# EAGLE design kolektorius_v2-be-klaidu (EAGLE 6.5.0)
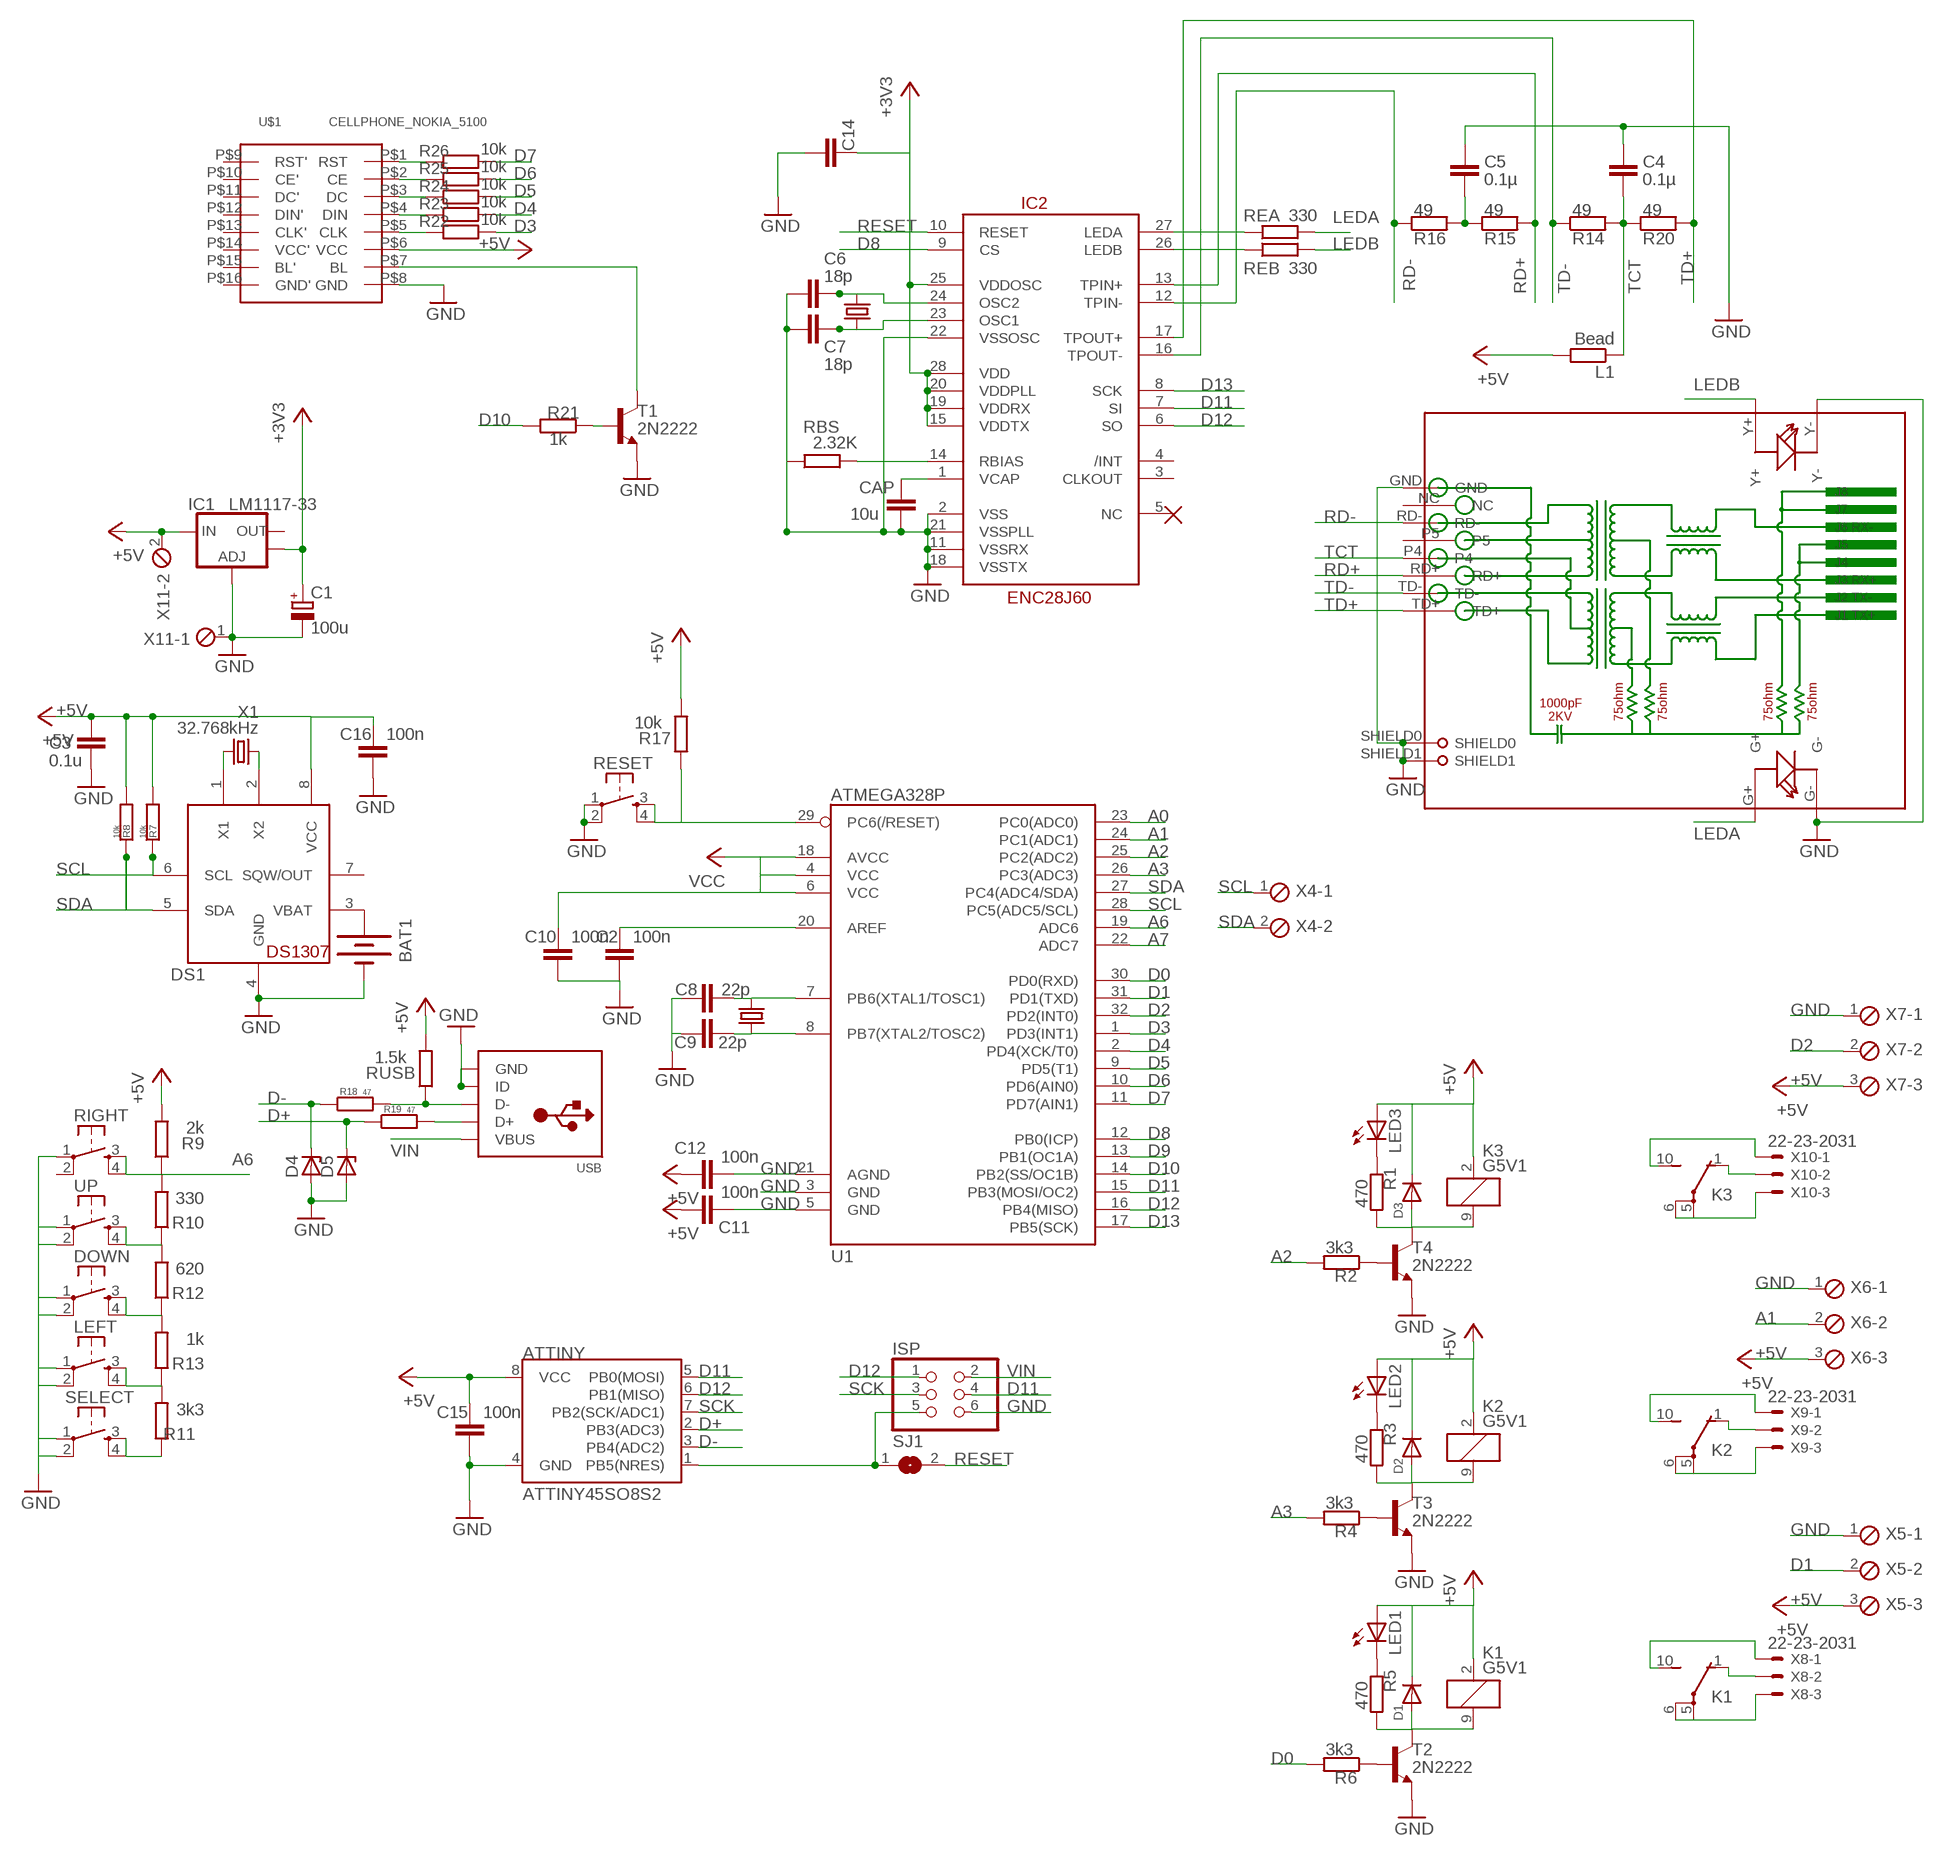
[diagram p0: schematic, sheet 1]

## Parts
ATTINY  ATTINY45SO8S2  [SO8S2]
BAT1  BATTERY20PTH  [BATTCOM_20MM_PTH]
C1  100u  CPOL-EUE2-5  [E2-5]
C2  100n  C-EUC0805  [C0805]
C3  0.1u  C-EUC0805  [C0805]
C4  0.1µ  C-EUC0805  [C0805]
C5  0.1µ  C-EUC0805  [C0805]
C6  18p  C-EUC0805  [C0805]
C7  18p  C-EUC0805  [C0805]
C8  22p  C-EUC0805  [C0805]
C9  22p  C-EUC0805  [C0805]
C10  100n  C-EUC0805  [C0805]
C11  100n  C-EUC0805  [C0805]
C12  100n  C-EUC0805  [C0805]
C14  100n  C-EUC0805  [C0805]
C15  100n  C-EUC0805  [C0805]
C16  100n  C-EUC0805  [C0805]
CAP  10u  C-EUC0805  [C0805]
D1  DIODEDO-1N4148  [DO-1N4148]
D2  DIODEDO-1N4148  [DO-1N4148]
D3  DIODEDO-1N4148  [DO-1N4148]
D4  ZENER-DIODEZD-5  [ZDIO-5]
D5  ZENER-DIODEZD-5  [ZDIO-5]
DOWN  TAC_SWITCHPTH  [TACTILE-PTH]
DS1  DS1307  DS1307SOIC  [SO08]
IC1  LM1117-33  V_REG_LM1117SOT223  [SOT223]
IC2  ENC28J60  [SSOP28DB]
ISP  PINHD-2X3  [2X03]
K1  G5V1  [G5V1]
K2  G5V1  [G5V1]
K3  G5V1  [G5V1]
L1  Bead  R-EU_R0805  [R0805]
LED1  LEDSMT1206  [1206]
LED2  LEDSMT1206  [1206]
LED3  LEDSMT1206  [1206]
LEFT  TAC_SWITCHPTH  [TACTILE-PTH]
R1  470  R-EU_R0805  [R0805]
R2  3k3  R-EU_R0805  [R0805]
R3  470  R-EU_R0805  [R0805]
R4  3k3  R-EU_R0805  [R0805]
R5  470  R-EU_R0805  [R0805]
R6  3k3  R-EU_R0805  [R0805]
R7  10k  R-EU_R0805  [R0805]
R8  10k  R-EU_R0805  [R0805]
R9  2k  R-EU_R0805  [R0805]
R10  330  R-EU_R0805  [R0805]
R11  3k3  R-EU_R0805  [R0805]
R12  620  R-EU_R0805  [R0805]
R13  1k  R-EU_R0805  [R0805]
R14  49  R-EU_R0805  [R0805]
R15  49  R-EU_R0805  [R0805]
R16  49  R-EU_R0805  [R0805]
R17  10k  R-EU_R0805  [R0805]
R18  47  R-EU_R0805  [R0805]
R19  47  R-EU_R0805  [R0805]
R20  49  R-EU_R0805  [R0805]
R21  1k  R-EU_R0805  [R0805]
R22  10k  R-EU_R0805  [R0805]
R23  10k  R-EU_R0805  [R0805]
R24  10k  R-EU_R0805  [R0805]
R25  10k  R-EU_R0805  [R0805]
R26  10k  R-EU_R0805  [R0805]
RBS  2.32K  R-EU_R0805  [R0805]
REA  330  R-EU_R0805  [R0805]
REB  330  R-EU_R0805  [R0805]
RESET  TAC_SWITCHPTH  [TACTILE-PTH]
RIGHT  TAC_SWITCHPTH  [TACTILE-PTH]
RJ1  HR911105A  [HR911105A]
RUSB  1.5k  R-EU_R0805  [R0805]
SELECT  TAC_SWITCHPTH  [TACTILE-PTH]
SJ1  SJ  [SJ]
T1  2N2222  [TO92-EBC-OVAL]
T2  2N2222  [TO92-EBC-OVAL]
T3  2N2222  [TO92-EBC-OVAL]
T4  2N2222  [TO92-EBC-OVAL]
U1  ATMEGA328P  ATMEGA328_SMT  [TQFP32-08]
U$1  CELLPHONE_NOKIA_5100  [CELLPHONE_NOKIA_5100_SPARKFUN]
UP  TAC_SWITCHPTH  [TACTILE-PTH]
USB  USBMOLEX  [USB-MINIB-THM-MOLEX]
X1  32.768kHz  CRYSTALTC26H  [TC26H]
X2  16MHz  CRYSTALHC49US  [HC49US]
X3  25MHz  CRYSTALHC49US  [HC49US]
X4  MPT2  [2POL254]
X5  MPT3  [3POL254]
X6  MPT3  [3POL254]
X7  MPT3  [3POL254]
X8  22-23-2031  [22-23-2031]
X9  22-23-2031  [22-23-2031]
X10  22-23-2031  [22-23-2031]
X11  MPT2  [2POL254]

## Nets
+3V3: C1.+ C14.1 IC1.4(OUT) IC2.15(VDDTX) IC2.19(VDDRX) IC2.20(VDDPLL) IC2.25(VDDOSC) IC2.28(VDD)
+5V: ATTINY.8(VCC) C3.1 C10.1 C11.2 C12.2 C15.1 C16.1 D1.C D2.C D3.C DS1.8(VCC) IC1.3(IN) K1.2 K2.2 K3.2 L1.2 LED1.A LED2.A R7.2 R8.2 R9.2 R17.2 RUSB.2 U1.4(VCC) U1.6(VCC) U1.18(AVCC) U$1.P$6(VCC) X5.3 X6.3 X7.3 X11.2 ; supply symbol labelled VCC
A0: U1.23(PC0(ADC0))
A1: U1.24(PC1(ADC1)) X6.2
A2: R2.2 U1.25(PC2(ADC2))
A3: R4.2 U1.26(PC3(ADC3))
A6: R9.1 R10.2 RIGHT.3 RIGHT.4 U1.19(ADC6)
A7: U1.22(ADC7)
D0: R6.2 U1.30(PD0(RXD))
D1: U1.31(PD1(TXD)) X5.2
D2: U1.32(PD2(INT0)) X7.2
D3: R22.2 U1.1(PD3(INT1))
D4: R23.2 U1.2(PD4(XCK/T0))
D5: R24.2 U1.9(PD5(T1))
D6: R25.2 U1.10(PD6(AIN0))
D7: R26.2 U1.11(PD7(AIN1))
D8: IC2.9(CS) U1.12(PB0(ICP))
D9: U1.13(PB1(OC1A))
D10: R21.2 U1.14(PB2(SS/OC1B))
D11: ATTINY.5(PB0(MOSI)) IC2.7(SI) ISP.4 U1.15(PB3(MOSI/OC2))
D12: ATTINY.6(PB1(MISO)) IC2.6(SO) ISP.1 U1.16(PB4(MISO))
D13: IC2.8(SCK) U1.17(PB5(SCK))
D+: ATTINY.2(PB3(ADC3)) D5.C R19.1
D-: ATTINY.3(PB4(ADC2)) D4.C R18.1
GND: ATTINY.4(GND) BAT1.2(-) C1.- C2.2 C3.2 C4.1 C5.1 C6.2 C7.2 C8.1 C9.1 C10.2 C11.1 C12.1 C14.2 C15.2 C16.2 CAP.2 D4.A D5.A DOWN.1 DOWN.2 DS1.4(GND) IC1.1(ADJ) IC2.2(VSS) IC2.11(VSSRX) IC2.18(VSSTX) IC2.21(VSSPLL) IC2.22(VSSOSC) ISP.6 LEFT.1 LEFT.2 RBS.1 RESET.1 RESET.2 RIGHT.1 RJ1.G- RJ1.GND RJ1.SHIELD0 RJ1.SHIELD1 RJ1.Y- SELECT.1 SELECT.2 T1.E T2.E T3.E T4.E U1.3(GND) U1.5(GND) U1.21(AGND) U$1.P$8(GND) UP.1 UP.2 USB.GND USB.ID X5.1 X6.1 X7.1 X11.1
LEDA: REA.2 RJ1.G+
LEDB: REB.2 RJ1.Y+
N$1: LEFT.3 LEFT.4 R11.2 R13.1
N$2: D2.A K2.9 R3.2 T3.C
N$3: R4.1 T3.B
N$4 [power]: K2.5(2:P) K2.6(2:P) X9.3
N$5 [power]: K2.1(2:O) X9.2
N$6: DOWN.3 DOWN.4 R12.1 R13.2
N$7: LED2.C R3.1
N$8: DS1.1(X1) X1.2
N$9: R10.1 R12.2 UP.3 UP.4
N$11: D1.A K1.9 R5.2 T2.C
N$12: D3.A K3.9 R1.2 T4.C
N$13: R2.1 T4.B
N$14 [power]: K2.10(2:S) X9.1
N$15 [power]: K1.10(2:S) X8.1
N$16 [power]: K3.10(2:S) X10.1
N$17: R6.1 T2.B
N$18: R11.1 SELECT.3 SELECT.4
N$19 [power]: K3.5(2:P) K3.6(2:P) X10.3
N$20 [power]: K3.1(2:O) X10.2
N$21: LED3.C R1.1
N$22: R22.1 U$1.P$5(CLK)
N$23: R25.1 U$1.P$2(CE)
N$24: R24.1 U$1.P$3(DC)
N$25: R23.1 U$1.P$4(DIN)
N$26 [signal]: T1.C U$1.P$7(BL)
N$27: LED3.A
N$28 [power]: K1.5(2:P) K1.6(2:P) X8.3
N$29 [power]: K1.1(2:O) X8.2
N$30: DS1.2(X2) X1.1
N$31: LED1.C R5.1
N$32: C9.2 U1.8(PB7(XTAL2/TOSC2)) X2.1
N$33: C8.2 U1.7(PB6(XTAL1/TOSC1)) X2.2
N$34: IC2.27(LEDA) REA.1
N$35: C2.1 U1.20(AREF)
N$36: BAT1.1(+) DS1.3(VBAT)
N$37: IC2.26(LEDB) REB.1
N$38: R19.2 USB.D+
N$39: CAP.1 IC2.1(VCAP)
N$41: C6.1 IC2.24(OSC2) X3.2
N$42: C7.1 IC2.23(OSC1) X3.1
N$44: R21.1 T1.B
N$45: R18.2 RUSB.1 USB.D-
N$46: R17.1 RESET.3 RESET.4 U1.29(PC6(/RESET))
N$52: ATTINY.1(PB5(NRES)) ISP.5 SJ1.1
N$54: C5.2 R15.1 R16.2
N$59: IC2.14(RBIAS) RBS.2
RD+: IC2.13(TPIN+) R15.2 RJ1.RD+
RD-: IC2.12(TPIN-) R16.1 RJ1.RD-
RESET: IC2.10(RESET) SJ1.2
SCK: ATTINY.7(PB2(SCK/ADC1)) ISP.3
SCL: DS1.6(SCL) R7.1 U1.28(PC5(ADC5/SCL)) X4.1
SDA: DS1.5(SDA) R8.1 U1.27(PC4(ADC4/SDA)) X4.2
TCT: C4.2 L1.1 R14.2 R20.1 RJ1.P4
TD+: IC2.17(TPOUT+) R20.2 RJ1.TD+
TD-: IC2.16(TPOUT-) R14.1 RJ1.TD-
V$: R26.1 U$1.P$1(RST)
VIN: ISP.2 USB.VBUS
Unconnected: DS1.7(SQW/OUT) IC1.2(OUT) IC2.3(CLKOUT) IC2.4(/INT) IC2.5(NC) RIGHT.2 RJ1.NC RJ1.P5 U$1.P$9(RST') U$1.P$10(CE') U$1.P$11(DC') U$1.P$12(DIN') U$1.P$13(CLK') U$1.P$14(VCC') U$1.P$15(BL') U$1.P$16(GND')

## Library data of the parts
ATTINY = SparkFun:ATTINY45: Atmel ATTiny45
BAT1 = SparkFun-Electromechanical:BATTERY: Battery Holders Various common sizes : AA, AAA, 20mm coin cell and 12mm coin cell. 20MM_4LEGS, BATT-10373
C1 = resistor:CPOL-EU: POLARIZED CAPACITOR, European symbol
C2 C4-C12 C14-C16 CAP = resistor:C-EU: CAPACITOR, European symbol
C3 = rcl:C-EU: CAPACITOR, European symbol
D1-D3 = adafruit:DIODE: Diode SMADIODE - SMA Surface Mount Package 20V 1A Schottky Diode Digikey: 641-1014-6-ND DO-1N4148 - Through Hole Small Current Diode SOD-123 20V 1 A (.5mV Vf) Schottky Diode - Digikey: MBRX120TPMSCT-ND SOD-323 10V 570mA (.38mV Vf, 3ns) Schottky Diode - Digikey: ZLLS410CT-ND SOD-523 30V 30mA Schottky Diode (RB751S-40TE61) - Digikey: RB751S-40TE61CT-ND SOT23-R/W - SOT23 Package (R = Solder Paste/Reflow Ovens, W = Hand-Soldering) BAT54Film 40V 300mA - Digikey: 497-7162-1-ND
D4 D5 = diode:ZENER-DIODE: Z-Diode
DOWN LEFT RESET RIGHT SELECT UP = SparkFun-Electromechanical:TAC_SWITCH: Momentary Switch Button commonly used for reset or general input. Spark Fun Electronics SKU : COM-00097 SMT- SWCH-08247
DS1 = adafruit:DS1307: DS1307 Real time clock (RTC) with battery backup ability. Talk to it via i2c
IC1 = SparkFun:V_REG_LM1117: Voltage Regulator LM1117 Standard adjustable voltage regulator but in SMD form. Spark Fun Electronics SKU : COM-00595
IC2 = SparkFun-DigitalIC:ENC28J60: Microchip SPI 10Base ethernet IC
ISP = pinhead:PINHD-2X3: PIN HEADER
K1-K3 = relay:G5V1: RELAY 1 x switch, 0.5 A/125 V AC, 1 A/24 V DC , Omron; MPN: G5V-1-DC24; OC_FARNELL: 9949593; OC_NEWARK: 36M6377
L1 R1-R26 RBS REA REB RUSB = rcl:R-EU_: RESISTOR, European symbol
LED1-LED3 = adafruit:LED: LED OSRAM: - CHIPLED LG R971, LG N971, LY N971, LG Q971, LY Q971, LO R971, LY R971 LH N974, LH R974 LS Q976, LO Q976, LY Q976 LO Q996 - Hyper CHIPLED LW Q18S LB Q993, LB Q99A, LB R99A - SideLED LS A670, LO A670, LY A670, LG A670, LP A670 LB A673, LV A673, LT A673, LW A673 LH A674 LY A675 LS A676, LA A676, LO A676, LY A676, LW A676 LS A679, LY A679, LG A679 - Hyper Micro SIDELED® LS Y876, LA Y876, LO Y876, LY Y876 LT Y87S - SmartLED LW L88C, LW L88S LB L89C, LB L89S, LG L890 LS L89K, LO L89K, LY L89K LS L896, LA L896, LO L896, LY L896 - TOPLED LS T670, LO T670, LY T670, LG T670, LP T670 LSG T670, LSP T670, LSY T670, LOP T670, LYG T670 LG T671, LOG T671, LSG T671 LB T673, LV T673, LT T673, LW T673 LH T674 LS T676, LA T676, LO T676, LY T676, LB T676, LH T676, LSB T676, LW T676 LB T67C, LV T67C, LT T67C, LS T67K, LO T67K, LY T67K, LW E67C LS E67B, LA E67B, LO E67B, LY E67B, LB E67C, LV E67C, LT E67C LW T67C LS T679, LY T679, LG T679 LS T770, LO T770, LY T770, LG T770, LP T770 LB T773, LV T773, LT T773, LW T773 LH T774 LS E675, LA E675, LY E675, LS T675 LS T776, LA T776, LO T776, LY T776, LB T776 LHGB T686 LT T68C, LB T68C - Hyper Mini TOPLED® LB M676 - Mini TOPLED Santana® LG M470 LS M47K, LO M47K, LY M47K Source: http://www.osram.convergy.de/
RJ1 = CONNECTER:HR911105A
SJ1 = jumper:SJ: SMD solder JUMPER
T1-T4 = adafruit:2N2222: NPN TRANSISTOR Big oval pads
U1 = SparkFun-DigitalIC:ATMEGA328_SMT: 32-Pin Atmega328 part Commonly used on Arduino compatible boards Available in QFP and QFN packages TQFP is IC-09069 QFN is non-stock; PROD_ID: IC-09069
U$1 = DIY-Cellphone:CELLPHONE_NOKIA_5100
USB = adafruit:USB: USB Connectors USBMINIB - Surface Mount Female Mini-B USB Connector 4UConnector: 06564 By microbuilder.eu Thru-hole RA Female Mini-B USB Connector 4UConnector: 18732 By ladyada.net
X1 = crystal:CRYSTAL: CRYSTAL; OC_FARNELL: unknown; OC_NEWARK: unknown
X2 X3 = SparkFun:CRYSTAL: Crystals Various standard crystals. Proven footprints. Spark Fun Electronics SKU : COM-00534
X4 X11 = con-phoenix-254:MPT2: PHOENIX CONNECTOR; OC_FARNELL: unknown; OC_NEWARK: unknown
X5-X7 = con-phoenix-254:MPT3: PHOENIX CONNECTOR; OC_FARNELL: unknown; OC_NEWARK: unknown
X8-X10 = con-molex:22-23-2031: .100" (2.54mm) Center Header - 3 Pin; MF: MOLEX; MPN: 22-23-2031; OC_FARNELL: 1462950; OC_NEWARK: 30C0862

## Net classes
0 default: width 0.406 mm, clearance 0.203 mm
1 power: width 0.61 mm, clearance 0.203 mm
2 GND: width 0.61 mm
3 signal: width 0.457 mm

## Board
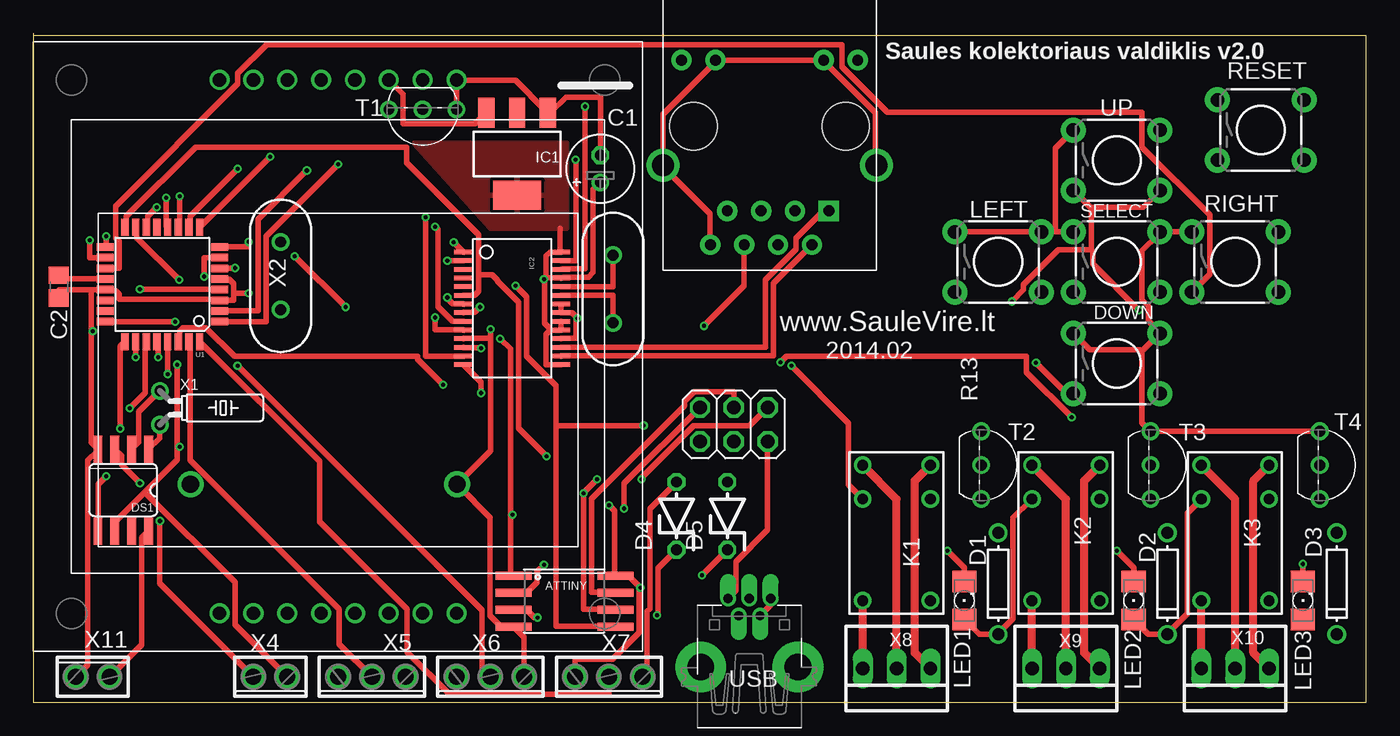
[diagram p1: board, top side]
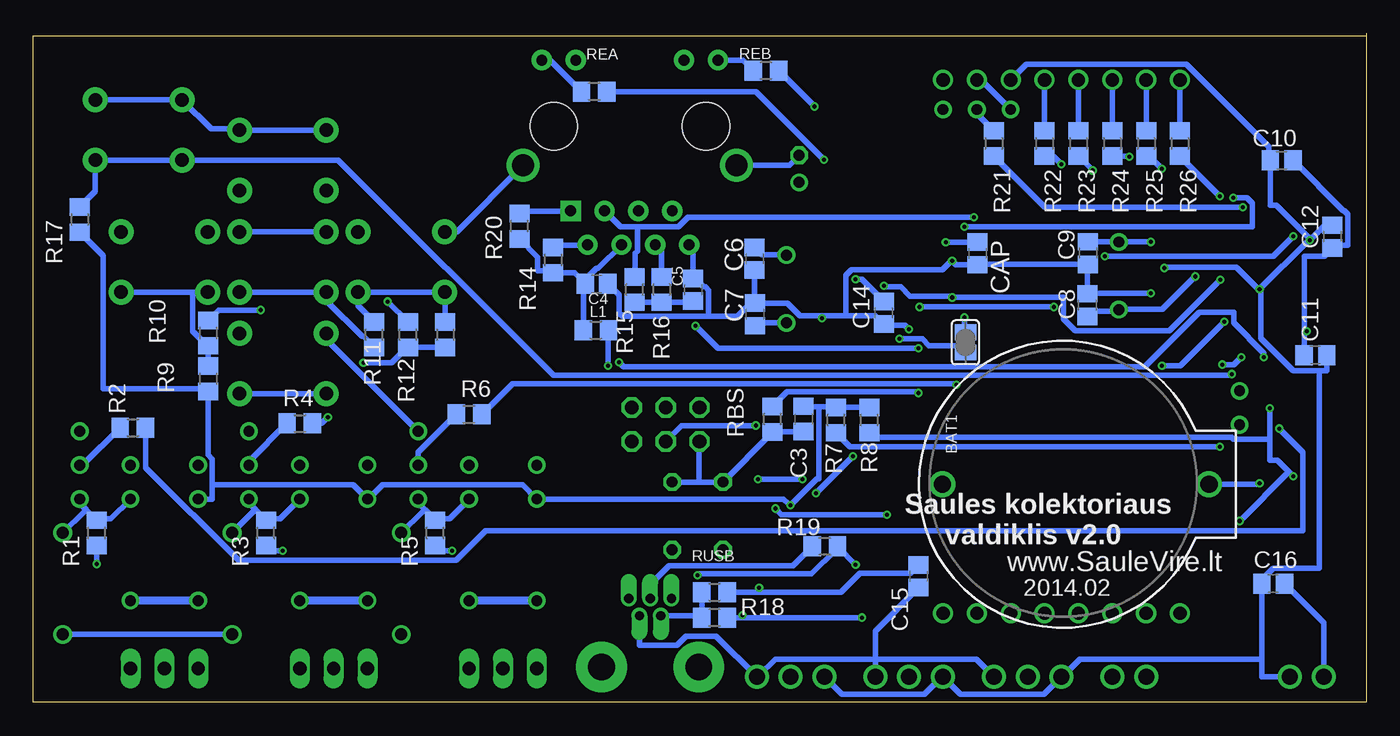
[diagram p2: board, bottom side, seen from below]

Size 100 x 50.16 mm. Coordinates in mm from the lower left corner, seen from the top.
Outline: 0,50 100,50 100,0 0,0 0,50.16
Copper layers (1*16): Top 0.035mm / dielectric 1.5mm / Bottom 0.035mm
Design rules "Fusion_eagle_rule_v1.1": minimum track width 6mil, minimum drill 12mil, track to track 6mil, track to pad 6mil, pad to pad 6mil, via to via 6mil, smd to smd 0mil, copper to edge 10mil, drill to drill 10mil, minimum pad ring 10mil, minimum via ring 6mil, stop-mask expansion 2mil, vias tented up to drill 100mil, thermal gap 10mil
vRestrict: area 32,73 to 71,78

### Footprints (pad centres in the part's own frame; a part is rotated, then mirrored left to right if it is on the bottom)
SO8S2 = smd 0.61 x 2.7: 1 -1.905,-3.778; 2 -0.635,-3.778; 3 0.635,-3.778; 4 1.905,-3.778; 5 1.905,3.853; 6 0.635,3.853; 7 -0.635,3.853; 8 -1.905,3.853
BATTCOM_20MM_PTH = drill 1.3: 1 20,0; 2 0,0
E2-5 = drill 0.813 pad 1.27: + -1.016,0 | drill 0.813 pad 1.27 octagon: - 1.016,0
C0805 = smd 1.3 x 1.5: 1 -0.85,0; 2 0.85,0
C0805' = smd 1.3 x 1.5: 1 -0.95,0; 2 0.95,0
DO-1N4148 = drill 0.9: A -3.81,0; C 3.81,0
ZDIO-5 = drill 0.813 octagon: A 2.54,0; C -2.54,0
TACTILE-PTH = drill 1.016 pad 1.88: 1 -3.251,2.261; 2 3.251,2.261; 3 -3.251,-2.261; 4 3.251,-2.261
SO08 = smd 0.66 x 2.032: 1 -1.905,-3.073; 2 -0.635,-3.073; 3 0.635,-3.073; 4 1.905,-3.073; 5 1.905,3.073; 6 0.635,3.073; 7 -0.635,3.073; 8 -1.905,3.073
SOT223 = smd 1.219 x 2.235: 1 -2.311,-3.099; 2 0,-3.099; 3 2.311,-3.099 | smd 3.6 x 2.2: 4 0,3.099
SSOP28DB = smd 0.348 x 1.397: 1 -4.225,-3.656; 2 -3.575,-3.656; 3 -2.925,-3.656; 4 -2.275,-3.656; 5 -1.625,-3.656; 6 -0.975,-3.656; 7 -0.325,-3.656; 8 0.325,-3.656; 9 0.975,-3.656; 10 1.625,-3.656; 11 2.275,-3.656; 12 2.925,-3.656; 13 3.575,-3.656; 14 4.225,-3.656; 15 4.225,3.656; 16 3.575,3.656; 17 2.925,3.656; 18 2.275,3.656; 19 1.625,3.656; 20 0.975,3.656; 21 0.325,3.656; 22 -0.325,3.656; 23 -0.975,3.656; 24 -1.625,3.656; 25 -2.275,3.656; 26 -2.925,3.656; 27 -3.575,3.656; 28 -4.225,3.656
2X03 = drill 1.016 octagon: 1 -2.54,-1.27; 2 -2.54,1.27; 3 0,-1.27; 4 0,1.27; 5 2.54,-1.27; 6 2.54,1.27
G5V1 = drill 0.813: 1 -5.08,-2.54; 2 -2.54,-2.54; 5 5.08,-2.54; 6 5.08,2.54; 9 -2.54,2.54; 10 -5.08,2.54
R0805 = smd 1.3 x 1.5: 1 -0.95,0; 2 0.95,0
1206 = smd 1.6 x 1.803: A -1.422,0; C 1.422,0
HR911105A = drill 0.813 pad 1.524: G+ 4.953,-6.604; G- 4.953,-4.064; GND -8.89,4.445; NC -6.35,3.175; P4 -8.89,-0.635; P5 -6.35,0.635; RD+ -6.35,-1.905; RD- -8.89,1.905; TD- -8.89,-3.175; Y+ 4.953,6.604; Y- 4.953,4.064 | drill 1.651 pad 2.159: SHIELD0 -2.921,8.001; SHIELD1 -2.921,-8.001 | drill 0.813 pad 1.524 square: TD+ -6.35,-4.445 | hole 3.556: 0,-5.715; 0,5.715
SJ = smd 1.168 x 1.6: 1 -0.762,0; 2 0.762,0
TO92-EBC-OVAL = drill 0.813: B 0,-1.27; C 2.54,-1.27; E -2.54,-1.27
TQFP32-08 = smd 1.27 x 0.559: 1 -4.293,2.8; 2 -4.293,2; 3 -4.293,1.2; 4 -4.293,0.4; 5 -4.293,-0.4; 6 -4.293,-1.2; 7 -4.293,-2; 8 -4.293,-2.8; 17 4.293,-2.8; 18 4.293,-2; 19 4.293,-1.2; 20 4.293,-0.4; 21 4.293,0.4; 22 4.293,1.2; 23 4.293,2; 24 4.293,2.8 | smd 0.559 x 1.27: 9 -2.8,-4.293; 10 -2,-4.293; 11 -1.2,-4.293; 12 -0.4,-4.293; 13 0.4,-4.293; 14 1.2,-4.293; 15 2,-4.293; 16 2.8,-4.293; 25 2.8,4.293; 26 2,4.293; 27 1.2,4.293; 28 0.4,4.293; 29 -0.4,4.293; 30 -1.2,4.293; 31 -2,4.293; 32 -2.8,4.293
CELLPHONE_NOKIA_5100_SPARKFUN = drill 1: P$1 -8.89,20; P$2 -6.35,20; P$3 -3.81,20; P$4 -1.27,20; P$5 1.27,20; P$6 3.81,20; P$7 6.35,20; P$8 8.89,20; P$9 -8.89,-20; P$10 -6.35,-20; P$11 -3.81,-20; P$12 -1.27,-20; P$13 1.27,-20; P$14 3.81,-20; P$15 6.35,-20; P$16 8.89,-20
USB-MINIB-THM-MOLEX = drill 0.7 offset: D+ 0,9.72; D- -0.8,8.42; GND 1.6,9.72; ID 0.8,8.42; VBUS -1.6,9.72 | drill 2 pad 3.81: GND1 -3.65,4.57; GND4 3.65,4.57
TC26H = drill 0.813: 1 -1.27,0; 2 1.27,0
HC49US = drill 0.813: 1 -2.54,0; 2 2.54,0
2POL254 = drill 1.2: 1 -1.27,0; 2 1.27,0
3POL254 = drill 1.2: 1 -2.54,0; 2 0,0; 3 2.54,0
22-23-2031 = drill 1 long: 1 -2.54,0; 2 0,0; 3 2.54,0

### Placement (x,y rotation side)
ATTINY  39.81,7.58 270 top
BAT1  31.8,16.35 0 bottom
C1  42.55,40.01 90 top
C2  1.91,31.17 270 top
C3  0.1u  [C0805']  42.21,21.24 270 bottom
C4  57.74,31.37 180 bottom
C5  50.49,30.93 270 bottom
C6  45.88,33.26 270 bottom
C7  45.86,29.09 90 bottom
C8  20.92,29.79 270 bottom
C9  20.87,33.69 90 bottom
C10  6.35,40.64 0 bottom
C11  3.81,26.04 0 bottom
C12  2.54,34.92 90 bottom
C14  36.2,29.21 270 bottom
C15  33.58,9.45 270 bottom
C16  6.99,8.89 0 bottom
CAP  29.16,33.66 270 bottom
D1  72.39,8.89 270 top
D2  85.09,8.89 270 top
D3  97.79,8.89 270 top
D4  48.26,13.97 90 top
D5  52.07,13.97 90 top
DOWN  81.28,25.4 0 top
DS1  6.75,15.91 180 top
IC1  36.3,41.12 180 top
IC2  35.93,29.54 270 top
ISP  52.56,20.83 180 top
K1  64.77,12.7 270 top
K2  77.47,12.7 270 top
K3  90.17,12.7 270 top
L1  57.8,27.91 0 bottom
LED1  69.85,7.62 90 top
LED2  82.55,7.62 90 top
LED3  95.25,7.62 90 top
LEFT  72.39,33.02 0 top
R1  95.25,12.7 90 bottom
R2  92.53,20.6 0 bottom
R3  82.55,12.7 90 bottom
R4  80.01,20.9 0 bottom
R5  69.85,12.7 90 bottom
R6  67.31,21.59 0 bottom
R7  39.78,21.16 90 bottom
R8  37.27,21.16 90 bottom
R9  86.87,24.26 270 bottom
R10  86.87,27.69 270 bottom
R11  74.42,27.56 90 bottom
R12  71.88,27.56 90 bottom
R13  69.09,27.56 270 bottom
R14  60.99,33.16 270 bottom
R15  54.88,30.95 90 bottom
R16  52.87,30.94 270 bottom
R17  96.52,36.2 270 bottom
R18  48.9,6.35 180 bottom
R19  40.62,11.68 180 bottom
R20  63.53,35.7 90 bottom
R21  27.94,41.91 270 bottom
R22  24.13,41.91 270 bottom
R23  21.59,41.91 270 bottom
R24  19.05,41.91 270 bottom
R25  16.51,41.91 270 bottom
R26  13.97,41.91 270 bottom
RBS  44.53,21.23 90 bottom
REA  57.92,45.8 180 bottom
REB  45.03,47.36 180 bottom
RESET  92.09,42.91 0 top
RIGHT  90.17,33.02 0 top
RJ1  55.24,43.2 90 top
RUSB  48.9,8.25 0 bottom
SELECT  81.28,33.02 0 top
SJ1  30.06,26.98 90 bottom
T1  29.21,43.18 180 top
T2  72.39,17.78 270 top
T3  85.09,17.78 270 top
T4  97.79,17.78 270 top
U1  9.68,31.34 180 top
U$1  22.86,26.67 0 top
UP  81.28,40.64 0 top
USB  53.72,-1.93 0 top
X1  9.49,22.08 270 top
X2  18.56,31.98 270 top
X3  43.49,30.99 90 top
X4  17.78,1.91 180 top
X5  25.4,1.91 180 top
X6  34.29,1.91 180 top
X7  43.18,1.91 180 top
X8  64.77,2.54 180 top
X9  77.47,2.54 180 top
X10  90.17,2.54 180 top
X11  4.45,1.91 0 top

### Tracks (layer width: path | path; a pad name or v marks a point on that pad's centre or on a via)
+3V3  (via drill 0.3)
  Top 0.406: 38.79,27.91 38.48,27.61 38.48,25.32 39.57,25.32 IC2.15 | 38.79,27.91 39.57,27.91 IC2.19 39.6,28.12 IC2.20 | 38.48,31.83 39.57,31.83 IC2.25 39.78,31.88 41.66,31.88 42.01,32.23 42.01,38.46 C1.+ | 38.48,31.83 38.48,33.48 38.76,33.76 39.57,33.76 IC2.28 39.52,33.96 39.52,35.56 | 38.48,31.83 v38.3,31.73 38.35,31.52 38.35,28.42 38.68,28.09 38.79,27.91
  Bottom 0.406: v38.3,31.73 37.85,31.73 36.2,30.07 C14.1
  pour Top: 28.57,41.91 40.01,41.91 40.01,35.56 34.29,35.56
+5V  (via drill 0.3)
  Top 0.406: LED2.A 83.67,5.08 D2.C 85.19,5.26 86.56,6.63 86.56,14.17 K3.2 | LED2.A | LED1.A 70.97,5.08 D1.C 72.49,5.26 73.51,6.27 73.51,13.82 K2.2 | LED1.A | IC1.3 33.96,44.2 33.15,43.38 27.74,43.38 27.74,45.59 U$1.P$6 | v4.24,34.65 4.24,33.35 U1.18 | v8,30.96 13.97,30.96 U1.4 | v15.14,32.56 13.99,32.56 U1.6 | X11.2 8.13,4.32 8.13,12.32 8.64,12.83 DS1.8 | X7.3 40.64,3.23 43.46,3.23 45.44,5.21 45.44,8.41 v45.54,8.59 44.68,9.45 43.87,9.45 ATTINY.8 43.61,9.68 43.61,14.35 v43.18,14.78 | v56.87,25.22 61.16,20.93 61.16,16.31 K1.2
  Bottom 0.406: D2.C D3.C | 86.56,16.31 86.56,15.24 K3.2 | 86.56,16.31 86.56,18.24 86.87,18.54 R9.2 86.94,23.5 94.77,23.5 94.77,33.48 R17.2 | 86.56,16.31 76,16.31 K2.2 74.75,15.34 73.79,16.31 63.3,16.31 K1.2 43.71,15.24 43.36,14.88 v43.18,14.78 41.2,16.76 41.05,16.76 41.05,22.15 | v4.24,34.65 3.12,35.76 C12.2 | v8,30.96 4.42,34.54 v4.24,34.65 | v15.14,32.56 15.06,32.64 9.75,32.64 8.18,31.06 v8,30.96 | 3.53,24.87 5.49,24.87 7.9,27.28 7.9,30.79 v8,30.96 | 3.53,24.87 2.97,24.87 2.97,26.04 C11.2 | v4.24,34.65 4.32,34.85 6.76,37.29 7.19,37.29 7.19,40.64 C10.1 7.29,40.82 7.29,41.66 13.49,47.85 25.5,47.85 26.67,46.69 U$1.P$6 | 7.82,3.23 7.82,1.91 X11.2 | 7.82,3.23 C16.1 7.72,9.07 7.72,9.3 6.96,10.06 3.53,10.06 3.53,24.87 | R8.2 37.29,22.12 39.78,22.12 R7.2 39.98,22.15 41.05,22.15 | X7.3 39.32,0.58 33.15,0.58 31.93,1.8 X6.3 30.43,0.58 24.18,0.58 X5.3 22.68,2.01 21.46,3.23 7.82,3.23 | 45.54,8.26 47.93,8.26 RUSB.2 | 45.54,8.26 39.4,8.26 37.97,9.68 34.19,9.68 33.58,10.29 C15.1 | v45.54,8.59 45.54,8.26 | 41.05,22.15 42.16,22.15 42.19,22.17 C3.1 | v56.87,25.22 56.87,27.89 L1.2
A1  (via drill 0.3)
  Top 0.406: v10.64,28.52 5.41,28.52 U1.24 | v15.32,25.22 33.66,6.88 33.66,2.54 X6.2
  Bottom 0.406: v10.64,28.52 13.95,25.22 v15.32,25.22
A2  (via drill 0.3)
  Top 0.406: v6.53,20.52 6.53,26.7 6.86,27.03 U1.25
  Bottom 0.406: v6.53,20.52 4.75,18.75 4.75,12.85 66.06,12.85 68.28,10.64 84.61,10.64 91.57,17.6 91.57,20.6 R2.2
A3  (via drill 0.3)
  Top 0.406: v7.67,25.88 7.67,27.03 U1.26 | v56.06,25.5 56.49,25.93 74.52,25.93 74.52,24.74 v77.9,21.36
  Bottom 0.406: v7.67,25.88 7.67,26.19 9.93,28.45 9.93,29.23 12.52,29.23 16.61,25.15 55.7,25.15 v56.06,25.5 | v77.9,21.36 78.36,20.9 R4.2
A6
  Top 0.406: RIGHT.3 88.27,32.11 88.27,36.55 83.19,41.63 83.19,44.25 64.08,44.25 60.66,47.68 60.66,49.33 17.5,49.33 15.34,47.17 15.34,46.38 6.17,37.21 6.17,34.85 6.45,34.57 6.45,32.56 5.41,32.56 U1.19
  Bottom 0.406: R9.1 R10.2 87.05,26.82 88.04,27.81 88.04,30.76 | RIGHT.3 88.04,30.76 | 88.04,30.76 RIGHT.4
D0  (via drill 0.3)
  Top 0.406: v30.73,23.8 28.83,25.7 28.83,25.93 15.09,25.93 12.93,28.09 11.23,28.09 10.97,27.84 10.97,27.13 10.9,27.05 U1.30
  Bottom 0.406: v30.73,23.8 30.84,23.9 64.03,23.9 66.34,21.59 R6.2
D1
  Top 0.406: X5.2 22.96,4.34 22.96,6.96 11.79,18.14 11.79,26.92 11.68,27.03 U1.31
D2
  Top 0.406: X7.2 43.18,0.58 31.22,0.58 28.04,3.76 28.04,6.96 21.46,13.54 21.46,18.06 12.5,27.03 U1.32
D3  (via drill 0.3)
  Top 0.406: v22.86,40.34 17.48,34.95 17.48,28.55 13.99,28.55 U1.1
  Bottom 0.406: v22.86,40.34 23.47,40.95 24.13,40.95 R22.2
D4  (via drill 0.3)
  Top 0.406: v20.52,39.88 16.87,36.22 16.87,29.36 13.99,29.36 U1.2
  Bottom 0.406: v20.52,39.88 21.59,40.95 R23.2
D5  (via drill 0.3)
  Top 0.406: v17.78,40.92 12.5,35.64 U1.9
  Bottom 0.406: v17.78,40.92 17.8,40.95 19.05,40.95 R24.2
D6  (via drill 0.3)
  Top 0.406: v15.34,40.01 11.79,36.45 11.79,35.74 U1.10
  Bottom 0.406: v15.34,40.01 16.28,40.95 16.51,40.95 R25.2
D7  (via drill 0.3)
  Top 0.406: v10.97,37.95 10.97,35.71 10.9,35.64 U1.11
  Bottom 0.406: v10.97,37.95 13.97,40.95 R26.2
D8  (via drill 0.3)
  Top 0.406: v9.98,37.82 9.98,35.71 10.06,35.64 U1.12 | v30.15,35.66 30.35,35.46 30.35,29.67 31.45,28.57 32.26,28.57 IC2.9
  Bottom 0.406: v9.98,37.82 8.94,37.82 8.53,37.41 8.53,35.66 v30.15,35.66
D10  (via drill 0.3)
  Top 0.406: U1.14 8.59,35.74 8.59,36.45 v9.25,37.11
  Bottom 0.406: v9.25,37.11 24.11,37.11 27.94,40.95 R21.2
D11  (via drill 0.3)
  Top 0.406: v10.95,31.67 7.77,34.85 7.77,35.53 7.7,35.61 U1.15 | v31.06,30.35 31.17,30.25 31.17,30.18 31.47,29.87 32.26,29.87 IC2.7 | 39.22,20.75 39.22,23.72 37.01,25.93 37.01,30.4 v36.17,31.24 | 39.22,20.75 39.22,5.69 43.66,5.69 ATTINY.5 | 39.22,20.75 v45.8,20.75
  Bottom 0.406: v10.95,31.67 14.76,27.86 21.82,27.86 22.71,28.75 22.71,30.35 v31.06,30.35 31.24,30.45 34.24,30.45 34.92,31.14 36.07,31.14 v36.17,31.24 | v45.8,20.75 51.38,20.75 52.55,19.58 ISP.4
D12  (via drill 0.3)
  Top 0.406: 33.4,32.05 33.4,30.84 33.1,30.53 32.28,30.53 IC2.6 | 33.4,32.05 33.4,35.08 28.02,40.46 28.02,41.63 12.17,41.63 6.99,36.45 6.99,35.74 U1.16 | v38.51,18.44 36.4,20.55 36.4,30 34.82,31.57 34.82,31.65 34.42,32.05 33.4,32.05 | ATTINY.6 43.66,6.96 41.27,6.96 v41.27,15.67 41.4,15.82 v42.29,16.71 | v45.64,16.71 45.64,16.84 49.53,20.73 49.53,20.75 53.75,20.75 ISP.1
  Bottom 0.406: v38.51,18.44 v41.27,15.67 | v42.29,16.71 v45.64,16.71
D13  (via drill 0.3)
  Top 0.406: v5.46,34.95 5.46,34.21 5.41,34.16 U1.17 | v23.42,29.64 v19.61,33.45 | v33.5,29.64 33.1,29.23 32.28,29.23 IC2.8
  Bottom 0.406: v5.46,34.95 6.96,33.45 v19.61,33.45 | v33.5,29.64 v23.42,29.64
D+  (via drill 0.3)
  Top 0.406: v38.3,10.31 37.8,9.8 37.8,8.99 37.03,8.23 36.04,8.23 ATTINY.2 | v50.16,9.53 D5.C
  Bottom 0.406: v38.3,10.31 39.65,11.66 R19.1 39.75,11.48 41.6,9.63 50.06,9.63 v50.16,9.53
D-  (via drill 0.3)
  Top 0.406: v37.82,6.35 37.59,6.35 37.01,6.93 36.04,6.93 ATTINY.3 | D4.C 46.86,10.03 46.86,6.6 v46.79,6.53
  Bottom 0.406: v37.82,6.35 46.79,6.35 | 46.79,6.35 R18.1 | v46.79,6.53 46.79,6.35
GND  (via drill 0.3)
  Top 0.406: 83.19,26.31 83.19,20.95 T3.E T4.E | 83.19,26.31 DOWN.2 84.43,27.84 83.67,28.6 83.67,29.72 83.19,30.2 83.19,33.86 84.43,35.1 SELECT.2 RIGHT.1 | DOWN.1 79.27,26.42 83.01,26.42 83.19,26.31 | LEFT.1 LEFT.2 76.68,35.28 | 76.68,35.28 SELECT.1 | UP.1 76.68,41.55 76.68,35.28 | 15.04,30.66 15.04,31.37 14.68,31.73 13.99,31.73 U1.5 | 15.04,30.66 15.04,30.15 13.99,30.15 U1.3 13.79,30.23 6.45,30.23 6.45,30.58 6.17,30.86 5.59,30.86 U1.21 4.34,30.94 | 4.34,30.94 1.93,30.94 1.93,30.33 C2.2 | 4.34,30.94 4.34,27.81 | 4.34,27.81 4.34,19.48 4.83,19 DS1.4 4.75,18.8 4.09,18.14 4.09,2.82 X11.1 | v4.47,27.81 4.34,27.81 | X6.1 36.83,4.88 36.04,5.66 ATTINY.4 35.81,5.69 35.05,5.69 34.27,6.48 34.27,13.84 31.93,16.18 BAT1.2 34.31,18.87 34.31,27.28 | USB.ID 54.53,6.5 55.3,7.26 55.3,7.77 USB.GND | T1.E U$1.P$8 36.17,46.66 37.31,45.52 37.31,45.49 38.58,44.22 IC1.1 38.81,44.25 39.95,45.39 42.55,45.39 C1.- | v31.06,33.1 32.26,33.1 IC2.2 | 40.72,28.8 40.72,28.91 40.41,29.21 IC2.21 39.6,29.41 39.6,29.84 IC2.22 | 40.72,28.8 40.72,27.28 IC2.18 | v40.82,28.8 40.72,28.8 | RJ1.GND 50.77,34.31 50.77,36.63 47.32,40.08 RJ1.SHIELD0 47.24,44.09 51.1,47.95 RJ1.Y- 59.28,48.16 RJ1.G- 59.41,47.98 63.2,44.2 63.2,40.31 63.22,40.28 RJ1.SHIELD1 | v16.15,30.66 15.04,30.66 | 34.31,27.28 32.28,27.28 IC2.11 | v34.31,27.96 34.31,27.28 | D4.A 46.25,14.5 46.25,7.01 46.05,6.81 46.05,2.23 X7.1
  Bottom 0.406: T2.E 78.03,27.23 DOWN.1 | UP.1 UP.2 84.71,43 86.67,43 88.82,45.16 RESET.1 89.03,45.19 95.33,45.19 RESET.2 | SELECT.1 SELECT.2 | LEFT.1 68.22,35.28 63.25,40.26 RJ1.SHIELD1 | 4.65,27.81 4.65,33.45 3.15,33.45 C12.1 2.46,34.27 1.37,34.27 1.37,36.6 1.63,36.85 1.7,36.85 5.49,40.64 C10.2 | 4.65,27.81 4.65,26.04 C11.1 | X11.1 3.17,5.94 6.12,8.89 C16.2 | v4.47,27.81 4.65,27.81 | C3.2 42.22,20.27 44.53,20.27 RBS.1 44.65,20.12 D4.A 50.04,16.51 | USB.ID 54.51,6.48 54.51,4.27 51.71,4.27 51.03,4.95 48.77,4.95 X7.1 45.54,2.01 44.32,3.23 36.83,3.23 | C1.- 43.28,40.28 47.22,40.28 RJ1.SHIELD0 | RJ1.GND 50.77,34.29 50.49,34.29 50.49,31.8 C5.1 50.29,31.73 49.73,31.17 49.58,31.17 49.33,30.91 49.33,28.93 | 40.82,28.98 42.49,28.98 43.43,29.92 45.85,29.92 C7.2 | 40.82,28.98 39.01,28.98 | 39.01,28.98 36.8,28.98 36.2,28.37 C14.2 36.02,28.27 34.62,28.27 v34.31,27.96 | C6.2 45.9,32.38 45.9,30.15 C7.2 | 49.33,28.93 47.17,28.93 46.23,29.87 46.05,29.87 C7.2 | 49.33,28.93 55.8,28.93 55.96,29.08 56.06,29.08 56.06,30.56 56.87,31.37 C4.1 | v40.82,28.8 40.82,28.98 | 39.01,28.98 39.01,32.03 38.61,32.44 31.8,32.44 31.24,32.99 v31.06,33.1 30.79,32.82 29.18,32.82 CAP.2 28.96,32.84 21.08,32.84 C9.1 20.88,32.82 20.9,32.82 20.9,30.66 C8.1 20.7,30.66 v16.15,30.66 | X6.1 36.83,3.23 | 36.83,3.23 36.83,5.33 33.58,8.59 C15.2 | X5.1 29.26,3.23 36.83,3.23 | 50.04,16.51 D5.A | 50.04,16.51 50.04,19.56 ISP.6
LEDA
  Bottom 0.406: REA.2 61.21,48.13 61.82,48.13 RJ1.G+
LEDB
  Bottom 0.406: REB.2 46,47.37 46.76,48.13 48.62,48.13 RJ1.Y+
N$1
  Bottom 0.406: R13.1 69.09,30.76 LEFT.3 LEFT.4 75.64,29.74 74.42,28.52 R11.2
N$2
  Bottom 0.406: 83.33,14.44 83.82,14.94 T3.C | 83.33,14.44 82.55,13.66 R3.2 82.37,13.77 81.48,13.77 K2.9 | D2.A 83.49,14.3 83.46,14.3 83.33,14.44
N$3
  Bottom 0.406: T3.B 83.82,18.06 80.97,20.9 R4.1
N$4
  Top 0.61: X9.3 K2.5
  Bottom 0.61: K2.5 K2.6
N$5
  Top 0.61: K2.1 77.47,15.24 X9.2
N$6  (via drill 0.3)
  Top 0.406: v75.23,25.45 77.55,23.14 DOWN.3
  Bottom 0.406: R13.2 R12.1 72.06,26.52 73.13,25.45 v75.23,25.45 | DOWN.3 DOWN.4
N$7  (via drill 0.3)
  Top 0.406: v81.28,11.35 82.55,10.08 LED2.C
  Bottom 0.406: v81.28,11.35 82.17,11.35 82.55,11.73 R3.1
N$8
  Top 0.406: DS1.1 8.66,19 9.47,19.81 9.47,20.8 X1.2
N$9  (via drill 0.3)
  Top 0.406: v73.41,30.05 74.3,30.94 74.3,31.32 76.91,33.93 79.38,33.93 | 79.38,37.03 79.38,33.93 | UP.3 79.38,37.03 | v82.96,29.41 79.48,32.89 79.48,33.76 79.38,33.93 | UP.4 83.29,37.13 79.55,37.13 79.38,37.03
  Bottom 0.406: v73.41,30.05 71.88,28.52 R12.2 | v82.96,29.41 86.11,29.41 R10.1
N$11
  Bottom 0.406: 70.62,14.44 71.12,14.94 T2.C | 70.62,14.44 69.85,13.66 R5.2 69.67,13.77 68.78,13.77 K1.9 | D1.A 70.79,14.3 70.76,14.3 70.62,14.44
N$12
  Bottom 0.406: 96.03,14.44 96.52,14.94 T4.C | 96.03,14.44 95.25,13.66 R1.2 95.07,13.77 94.18,13.77 K3.9 | D3.A 96.19,14.3 96.16,14.3 96.03,14.44
N$13
  Bottom 0.406: T4.B 96.32,17.78 93.5,20.6 R2.1
N$14
  Top 0.61: K2.10 78.84,16.61 78.84,3.71 X9.1
N$15
  Top 0.61: K1.10 66.14,16.61 66.14,3.71 X8.1
N$16
  Top 0.61: K3.10 91.54,16.61 91.54,3.71 X10.1
N$17
  Bottom 0.406: T2.B 71.12,18.75 68.28,21.59 R6.1
N$18
  Bottom 0.406: R11.1 75.23,27.43 75.34,27.43 78.03,30.12 SELECT.3 SELECT.4
N$19
  Top 0.61: X10.3 K3.5
  Bottom 0.61: K3.5 K3.6
N$20
  Top 0.61: K3.1 90.17,15.24 X10.2
N$21  (via drill 0.3)
  Top 0.406: LED3.C v95.25,10.36
  Bottom 0.406: v95.25,10.36 R1.1
N$22
  Bottom 0.406: U$1.P$5 R22.1
N$23
  Bottom 0.406: U$1.P$2 R25.1
N$24
  Bottom 0.406: U$1.P$3 R24.1
N$25
  Bottom 0.406: U$1.P$4 R23.1
N$26
  Bottom 0.457: T1.C 28.88,46.66 U$1.P$7
N$28
  Top 0.61: X8.3 K1.5
  Bottom 0.61: K1.5 K1.6
N$29
  Top 0.61: K1.1 64.77,15.24 X8.2
N$30
  Top 0.406: DS1.2 7.39,19 7.9,19.51 7.9,21.77 9.47,23.34 X1.1
N$31  (via drill 0.3)
  Top 0.406: v68.58,11.35 69.85,10.08 LED1.C
  Bottom 0.406: v68.58,11.35 69.47,11.35 69.85,11.73 R5.1
N$32  (via drill 0.3)
  Top 0.406: v16.15,34.52 16.15,34.16 13.99,34.16 U1.8
  Bottom 0.406: v16.15,34.52 18.54,34.52 X2.1 18.75,34.54 20.85,34.54 C9.2
N$33  (via drill 0.3)
  Top 0.406: v12.83,31.93 12.83,33.33 13.97,33.33 U1.7
  Bottom 0.406: v12.83,31.93 15.29,29.46 18.54,29.46 X2.2 18.75,29.34 20.52,29.34 20.9,28.96 C8.2
N$34  (via drill 0.3)
  Top 0.406: v40.69,40.69 40.72,40.66 40.72,33.12 IC2.27
  Bottom 0.406: v40.69,40.69 45.77,45.77 56.95,45.77 REA.1
N$35
  Top 0.406: U1.20 1.93,31.75 1.93,32 C2.1
N$36  (via drill 0.3)
  Top 0.406: v8,16.43 6.63,17.8 6.63,18.47 6.12,18.97 DS1.3
  Bottom 0.406: v8,16.43 8.08,16.36 11.79,16.36 BAT1.1
N$37  (via drill 0.3)
  Top 0.406: v41.4,44.68 41.4,32.51 39.7,32.51 39.67,32.49 39.6,32.49 IC2.26
  Bottom 0.406: v41.4,44.68 44.07,47.35 REB.1
N$38
  Bottom 0.406: R19.2 41.58,11.66 43,10.24 52.32,10.24 53.7,8.87 53.7,7.8 USB.D+
N$39  (via drill 0.3)
  Top 0.406: v31.55,34.49 32.26,33.78 IC2.1
  Bottom 0.406: v31.55,34.49 29.18,34.49 CAP.1
N$41
  Top 0.406: IC2.24 43.48,31.17 X3.2
  Bottom 0.406: C6.1 45.87,34.09 45.34,33.55 43.51,33.55 X3.2
N$42
  Top 0.406: IC2.23 39.6,30.5 43.48,30.5 43.48,28.47 X3.1
  Bottom 0.406: C7.1 45.85,28.25 45.64,28.45 43.51,28.45 X3.1
N$44
  Bottom 0.406: T1.B 29.21,44.15 27.94,42.88 R21.1
N$45
  Bottom 0.406: RUSB.1 49.84,8.23 49.84,6.35 R18.2 50.04,6.43 50.09,6.48 52.91,6.48 USB.D-
N$46  (via drill 0.3)
  Top 0.406: v10.08,24.61 10.08,27.03 U1.29
  Bottom 0.406: R17.1 95.35,38.33 95.35,40.64 RESET.4 95.15,40.64 89.03,40.64 RESET.3 88.82,40.64 77.11,40.64 60.98,24.51 10.19,24.51 v10.08,24.61
N$52  (via drill 0.3)
  Top 0.406: v35.03,27.25 35.79,26.49 35.79,14.07 | 35.79,14.07 35.79,9.73 36.02,9.5 ATTINY.1 | v44.32,14.53 44.32,16.41 ISP.5 | v35.97,14.07 35.79,14.07
  Bottom 0.406: v35.03,27.25 33.3,27.25 32.79,26.75 30.58,26.75 30.07,26.24 SJ1.1 | v44.32,14.53 43.87,14.07 v35.97,14.07
N$54
  Bottom 0.406: C5.2 50.57,30 52.86,30 R16.2 53.06,30 54.86,30 R15.1
N$59  (via drill 0.3)
  Top 0.406: v33.6,23.19 33.6,23.98 32.28,25.3 IC2.14
  Bottom 0.406: v33.6,23.19 33.68,23.27 43.46,23.27 44.53,22.2 RBS.2
RD+  (via drill 0.3)
  Top 0.406: v29.44,36.37 29.44,25.96 32.26,25.96 IC2.13
  Bottom 0.406: v29.44,36.37 50.88,36.37 51.59,35.66 54.69,35.66 | 54.69,35.66 55.96,35.66 57.12,36.83 RJ1.RD+ | 54.69,35.66 54.69,33.83 54.86,33.66 54.86,31.9 R15.2
RD-  (via drill 0.3)
  Top 0.406: v33.6,26.54 33.6,26.59 32.28,26.59 IC2.12 | v50.32,28.22 53.31,31.22 53.31,34.29 RJ1.RD-
  Bottom 0.406: v33.6,26.54 48.64,26.54 v50.32,28.22 | R16.1 52.88,31.9 52.88,34.29 53.31,34.29 RJ1.RD-
RESET  (via drill 0.3)
  Top 0.406: v30.15,28.85 30.15,27.94 32.26,27.94 IC2.10
  Bottom 0.406: v30.15,28.85 30.15,27.76 30.07,27.76 SJ1.2
SCK
  Top 0.406: ATTINY.7 43.66,8.23 41.88,8.23 41.88,15.27 48.84,22.23 48.84,22.58 49.55,23.29 52.55,23.29 52.55,22.12 ISP.3
SCL  (via drill 0.3)
  Top 0.406: v9.37,25.88 9.37,26.95 9.3,27.03 U1.28 | 10.79,19.15 10.79,18.19 8.37,15.76 | 10.79,19.15 v10.79,25.32 | 8.37,15.76 6.12,13.51 6.12,12.85 DS1.6 | v10.97,19.15 10.79,19.15 | X4.1 15.14,5.82 15.14,8.99 8.37,15.76
  Bottom 0.406: v9.37,25.88 9.93,25.32 v10.79,25.32 | v10.97,19.15 38.73,19.15 39.78,20.19 R7.1
SDA  (via drill 0.3)
  Top 0.406: U1.27 8.38,26.95 8.38,23.19 v7.24,22.05 | v5.46,16.94 4.85,16.33 4.85,12.85 DS1.5 | X4.2 9.5,8.91 v9.5,13.59
  Bottom 0.406: 7.24,19.74 7.24,18.16 6.68,18.16 5.8,17.29 | 7.24,19.74 v7.24,22.05 | v5.46,16.94 5.8,17.29 | 7.24,19.74 9.96,19.74 10.08,19.86 36.93,19.86 37.26,20.19 R8.1 | 5.8,17.29 v9.5,13.59
TCT
  Bottom 0.406: C4.2 58.6,31.39 59.41,32.21 R14.2 61.14,32.36 62.15,32.36 62.15,33.38 R20.1 | L1.1 58.73,27.91 58.73,31.22 C4.2 | RJ1.P4 55.88,34.29 57.63,32.54 57.73,32.54 58.6,31.67 C4.2
TD+
  Top 0.406: IC2.17 54.91,26.62 54.91,31.67 57.23,33.98 57.23,34.8 59.26,36.83 59.66,36.83 RJ1.TD+
  Bottom 0.406: R20.2 63.35,36.83 59.69,36.83 RJ1.TD+
TD-
  Top 0.406: IC2.16 39.6,25.98 55.52,25.98 55.52,31.42 58.4,34.29 RJ1.TD-
  Bottom 0.406: R14.1 60.81,34.29 58.42,34.29 RJ1.TD-
V$
  Bottom 0.406: U$1.P$1 R26.1
VIN
  Top 0.406: USB.VBUS 52.7,8.38 52.7,10.54 55.09,12.93 ISP.2

### Text on the board
tNames: Saules kolektoriaus valdiklis v2.0 | www.SauleVire.lt | 2014.02
bNames: Saules kolektoriaus / valdiklis v2.0 | www.SauleVire.lt | 2014.02
BoxDim: Serpac WM-032C Enclosure | All units are in inch | Left | Right | Front | Bottom